# EAGLE design PGTNXEN_gate_out (EAGLE 8.5.2)
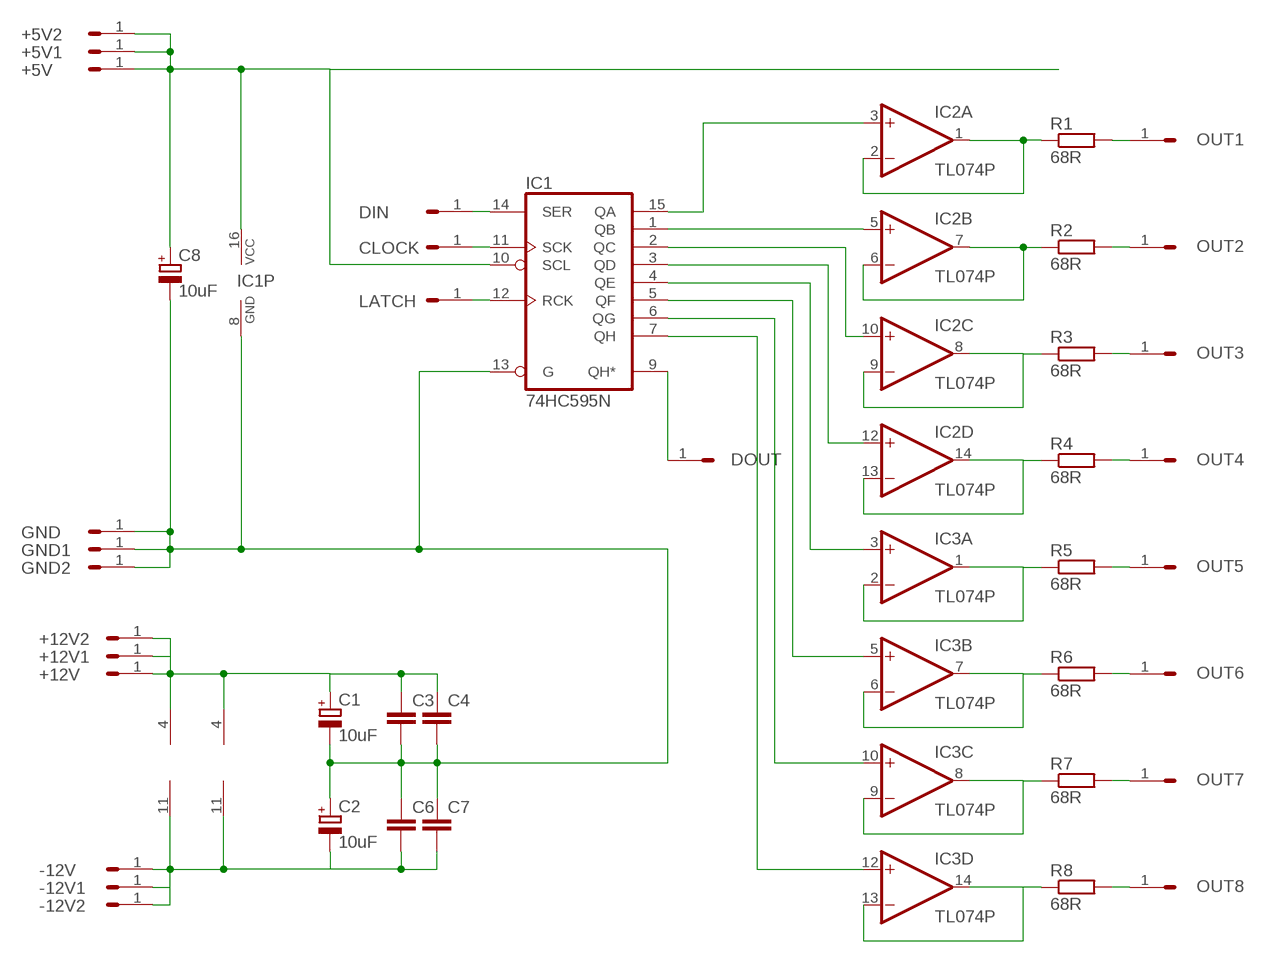
[diagram p0: schematic, sheet 1]

## Parts
+5V  HEADER/MALE/01  [HEADER/MALE/01]
+5V1  HEADER/MALE/01  [HEADER/MALE/01]
+5V2  HEADER/MALE/01  [HEADER/MALE/01]
+12V  HEADER/MALE/01  [HEADER/MALE/01]
+12V1  HEADER/MALE/01  [HEADER/MALE/01]
+12V2  HEADER/MALE/01  [HEADER/MALE/01]
-12V  HEADER/MALE/01  [HEADER/MALE/01]
-12V1  HEADER/MALE/01  [HEADER/MALE/01]
-12V2  HEADER/MALE/01  [HEADER/MALE/01]
C1  10uF  CAPACITOR/POLARIZEDE2.5-6  [E2,5-6]
C2  10uF  CAPACITOR/POLARIZEDE2.5-6  [E2,5-6]
C3  CAPACITORCERAMICDISC/5  [CERAMICDISC/5]
C4  CAPACITORCERAMICDISC/5  [CERAMICDISC/5]
C6  CAPACITORCERAMICDISC/5  [CERAMICDISC/5]
C7  CAPACITORCERAMICDISC/5  [CERAMICDISC/5]
C8  10uF  CAPACITOR/POLARIZEDE2.5-6  [E2,5-6]
CLOCK  HEADER/MALE/01  [HEADER/MALE/01]
DIN  HEADER/MALE/01  [HEADER/MALE/01]
DOUT  HEADER/MALE/01  [HEADER/MALE/01]
GND  HEADER/MALE/01  [HEADER/MALE/01]
GND1  HEADER/MALE/01  [HEADER/MALE/01]
GND2  HEADER/MALE/01  [HEADER/MALE/01]
IC1  74HC595N  [DIL16]
IC2  TL074P  [DIL14]
IC3  TL074P  [DIL14]
LATCH  HEADER/MALE/01  [HEADER/MALE/01]
OUT1  HEADER/MALE/01  [HEADER/MALE/01]
OUT2  HEADER/MALE/01  [HEADER/MALE/01]
OUT3  HEADER/MALE/01  [HEADER/MALE/01]
OUT4  HEADER/MALE/01  [HEADER/MALE/01]
OUT5  HEADER/MALE/01  [HEADER/MALE/01]
OUT6  HEADER/MALE/01  [HEADER/MALE/01]
OUT7  HEADER/MALE/01  [HEADER/MALE/01]
OUT8  HEADER/MALE/01  [HEADER/MALE/01]
R1  68R  RESISTORRESISTOR/UPRIGHT/7.5  [RESISTOR/7.5]
R2  68R  RESISTORRESISTOR/UPRIGHT/7.5  [RESISTOR/7.5]
R3  68R  RESISTORRESISTOR/UPRIGHT/7.5  [RESISTOR/7.5]
R4  68R  RESISTORRESISTOR/UPRIGHT/7.5  [RESISTOR/7.5]
R5  68R  RESISTORRESISTOR/UPRIGHT/7.5  [RESISTOR/7.5]
R6  68R  RESISTORRESISTOR/UPRIGHT/7.5  [RESISTOR/7.5]
R7  68R  RESISTORRESISTOR/UPRIGHT/7.5  [RESISTOR/7.5]
R8  68R  RESISTORRESISTOR/UPRIGHT/7.5  [RESISTOR/7.5]

## Nets
CLK: +5V1.1 +5V2.1 +5V.1 C8.+ IC1.10(SCL) IC1.16(VCC)
GND: C1.- C2.+ C3.2 C4.2 C6.1 C7.1 C8.- GND1.1 GND2.1 GND.1 IC1.8(GND) IC1.13(G)
N$1: IC1.15(QA) IC2.3(A:+IN)
N$2: IC1.1(QB) IC2.5(B:+IN)
N$3: CLOCK.1 IC1.11(SCK)
N$4: DIN.1 IC1.14(SER)
N$5: IC1.12(RCK) LATCH.1
N$6: IC1.2(QC) IC2.10(C:+IN)
N$7: IC1.3(QD) IC2.12(D:+IN)
N$8: IC1.4(QE) IC3.3(A:+IN)
N$9: IC1.5(QF) IC3.5(B:+IN)
N$10: IC1.6(QG) IC3.10(C:+IN)
N$11: IC1.7(QH) IC3.12(D:+IN)
N$12: DOUT.1 IC1.9(QH*)
N$13: IC2.1(A:OUT) IC2.2(A:-IN) R1.1
N$14: OUT1.1 R1.2
N$15: IC2.6(B:-IN) IC2.7(B:OUT) R2.1
N$16: OUT2.1 R2.2
N$17: +12V1.1 +12V2.1 +12V.1 C1.+ C3.1 C4.1 IC2.4(P:V+) IC3.4(P:V+)
N$18: -12V1.1 -12V2.1 -12V.1 C2.- C6.2 C7.2 IC2.11(P:V-) IC3.11(P:V-)
N$21: IC2.8(C:OUT) IC2.9(C:-IN) R3.1
N$22: IC2.13(D:-IN) IC2.14(D:OUT) R4.1
N$23: IC3.1(A:OUT) IC3.2(A:-IN) R5.1
N$24: IC3.6(B:-IN) IC3.7(B:OUT) R6.1
N$25: IC3.8(C:OUT) IC3.9(C:-IN) R7.1
N$26: IC3.13(D:-IN) IC3.14(D:OUT) R8.1
N$27: OUT3.1 R3.2
N$28: OUT4.1 R4.2
N$29: OUT5.1 R5.2
N$30: OUT6.1 R6.2
N$31: OUT7.1 R7.2
N$32: OUT8.1 R8.2

## Library data of the parts
+5V +5V1 +5V2 +12V +12V1 +12V2 -12V -12V1 -12V2 CLOCK DIN DOUT GND GND1 GND2 LATCH OUT1-OUT8 = connectors:HEADER/MALE/01
C1 C2 C8 = capacitors:CAPACITOR/POLARIZED: POLARIZED CAPACITOR, European symbol
C3 C4 C6 C7 = capacitors:CAPACITOR: CAPACITOR, European symbol
IC1 = ic_digital:74*595: 8-bit SHIFT REGISTER, output latch
IC2 IC3 = ic_analogue:TL074: OP AMP
R1-R8 = resistors:RESISTOR: RESISTOR, European symbol

## Board
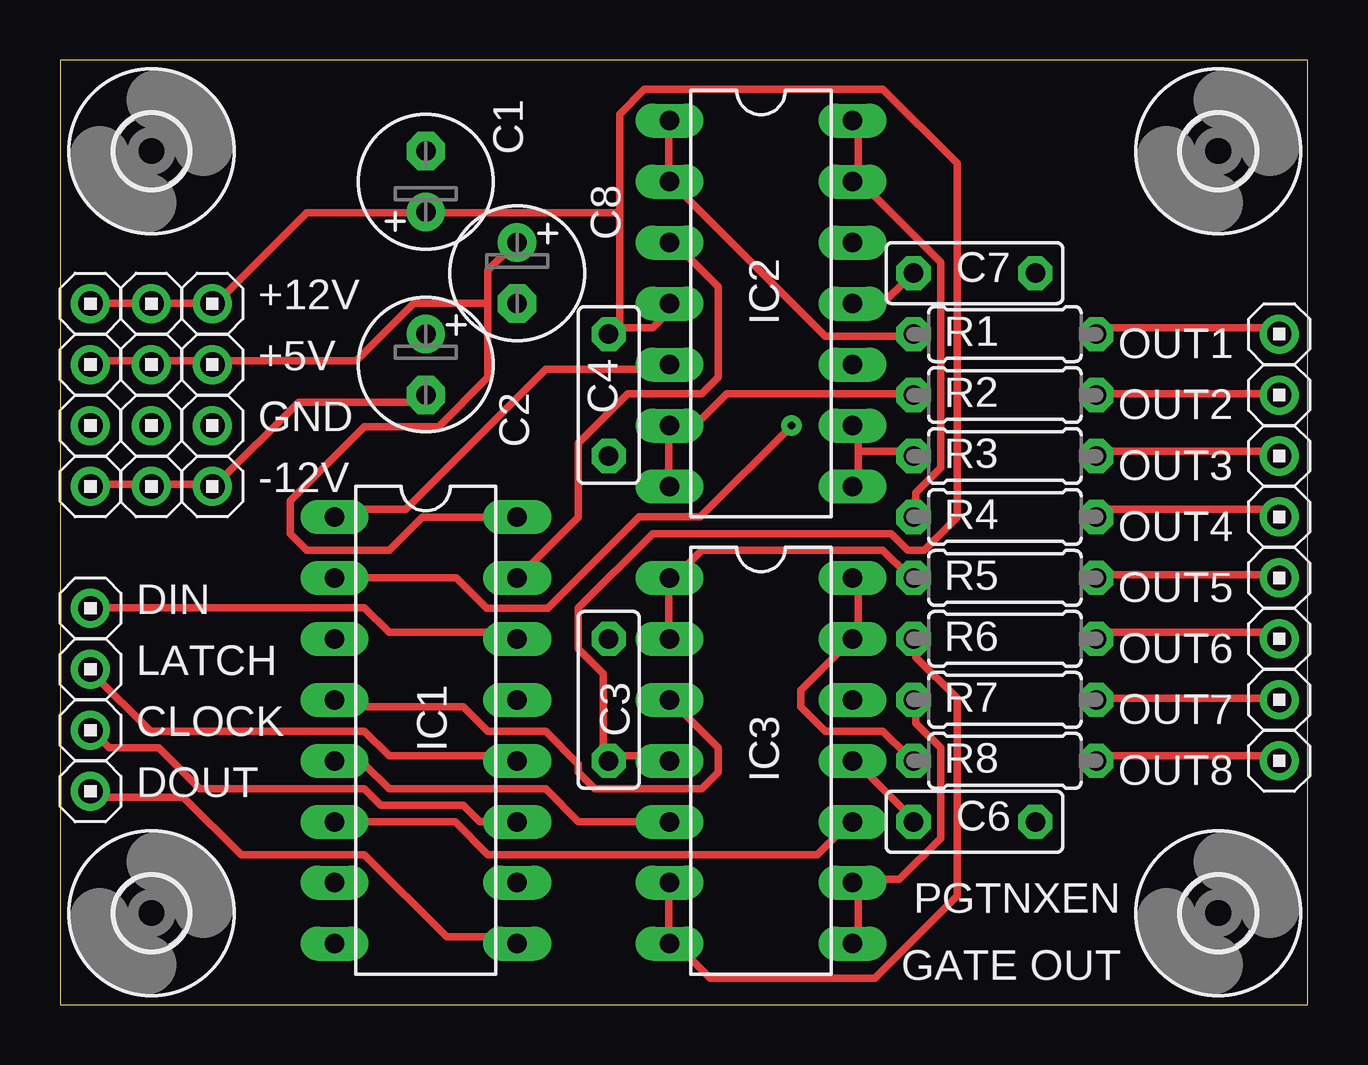
[diagram p1: board, top side]
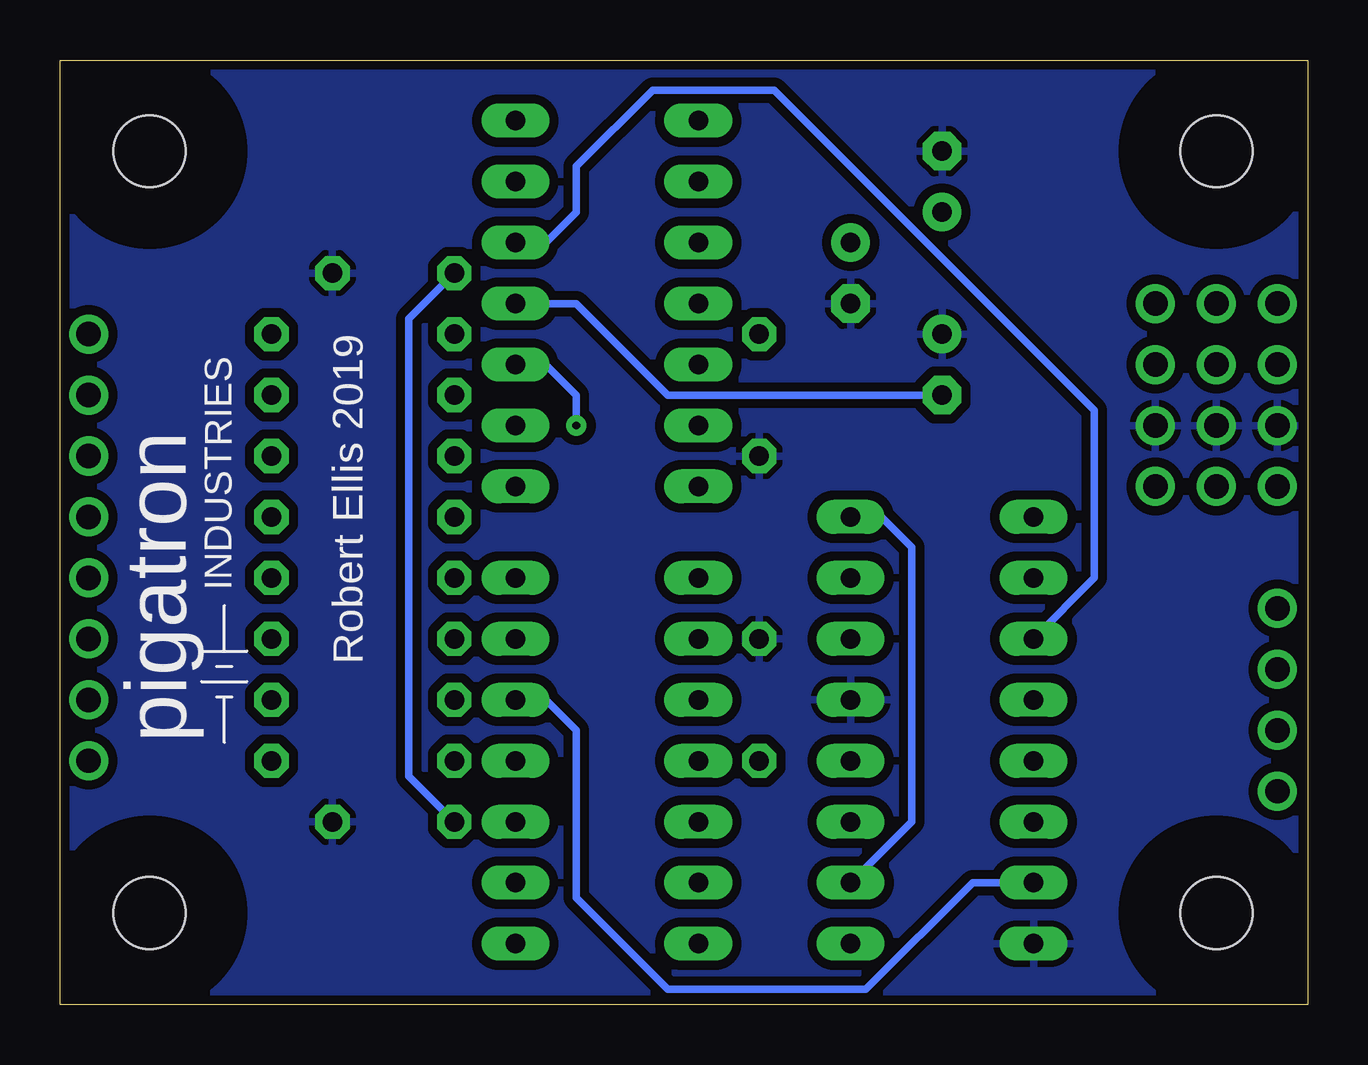
[diagram p2: board, bottom side, seen from below]

Size 51.99 x 39.36 mm. Coordinates in mm from the lower left corner, seen from the top.
Outline: 0,0 51.99,0 51.99,39.36 0,39.36 0,0
Copper layers (1*16): Top 0.0356mm / dielectric 1.5011mm / Bottom 0.0356mm
Design rules "pigatron": minimum track width 12mil, minimum drill 13mil, track to track 15mil, track to pad 10mil, pad to pad 10mil, via to via 10mil, smd to smd 6mil, copper to edge 15mil, drill to drill 10mil, minimum pad ring 12mil, minimum via ring 10mil, stop-mask expansion 4mil, vias tented up to drill 0mil, thermal gap 10mil

### Footprints (pad centres in the part's own frame; a part is rotated, then mirrored left to right if it is on the bottom)
HEADER/MALE/01 = drill 1.016: 1 0,0
E2,5-6 = drill 0.813 pad 1.6: + -1.27,0 | drill 0.813 pad 1.6 octagon: - 1.27,0
CERAMICDISC/5 = drill 0.813 octagon: 1 -2.54,0; 2 2.54,0
DIL16 = drill 0.813 long: 1 -8.89,-3.81; 2 -6.35,-3.81; 3 -3.81,-3.81; 4 -1.27,-3.81; 5 1.27,-3.81; 6 3.81,-3.81; 7 6.35,-3.81; 8 8.89,-3.81; 9 8.89,3.81; 10 6.35,3.81; 11 3.81,3.81; 12 1.27,3.81; 13 -1.27,3.81; 14 -3.81,3.81; 15 -6.35,3.81; 16 -8.89,3.81
DIL14 = drill 0.813 long: 1 -7.62,-3.81; 2 -5.08,-3.81; 3 -2.54,-3.81; 4 0,-3.81; 5 2.54,-3.81; 6 5.08,-3.81; 7 7.62,-3.81; 8 7.62,3.81; 9 5.08,3.81; 10 2.54,3.81; 11 0,3.81; 12 -2.54,3.81; 13 -5.08,3.81; 14 -7.62,3.81
RESISTOR/7.5 = drill 0.813 octagon: 1 -3.81,0; 2 3.81,0
STANDOFF/3.0 = hole 3: 0,0

### Placement (x,y rotation side)
+5V  6.35,26.67 0 top
+5V1  3.81,26.67 0 top
+5V2  1.27,26.67 0 top
+12V  6.35,29.21 0 top
+12V1  3.81,29.21 0 top
+12V2  1.27,29.21 0 top
-12V  6.35,21.59 0 top
-12V1  3.81,21.59 0 top
-12V2  1.27,21.59 0 top
C1  15.24,34.29 90 top
C2  15.24,26.67 270 top
C3  22.86,12.7 90 top
C4  22.86,25.4 270 top
C6  38.1,7.62 180 top
C7  38.1,30.48 180 top
C8  19.05,30.48 270 top
CLOCK  1.27,11.43 0 top
DIN  1.27,16.51 0 top
DOUT  1.27,8.89 0 top
GND  6.35,24.13 0 top
GND1  1.27,24.13 0 top
GND2  3.81,24.13 0 top
IC1  15.24,11.43 270 top
IC2  29.21,29.21 270 top
IC3  29.21,10.16 270 top
LATCH  1.27,13.97 0 top
OUT1  50.8,27.94 180 top
OUT2  50.8,25.4 180 top
OUT3  50.8,22.86 180 top
OUT4  50.8,20.32 180 top
OUT5  50.8,17.78 180 top
OUT6  50.8,15.24 180 top
OUT7  50.8,12.7 180 top
OUT8  50.8,10.16 180 top
R1  39.37,27.94 0 top
R2  39.37,25.4 0 top
R3  39.37,22.86 0 top
R4  39.37,20.32 0 top
R5  39.37,17.78 0 top
R6  39.37,15.24 0 top
R7  39.37,12.7 0 top
R8  39.37,10.16 0 top
U$1  [STANDOFF/3.0]  3.81,3.81 0 top
U$2  [STANDOFF/3.0]  48.26,3.81 0 top
U$3  [STANDOFF/3.0]  48.26,35.56 0 top
U$4  [STANDOFF/3.0]  3.81,35.56 0 top
U$5  [PIGATRON-LOGO]  46.74,19.81 90 bottom

### Tracks (layer width: path | path; a pad name or v marks a point on that pad's centre or on a via)
CLK
  Top 0.305: +5V2.1 1.37,26.82 3.77,26.82 +5V1.1 4.12,26.82 6.17,26.82 +5V.1 6.51,26.82 12.34,26.82 14.74,29.22 17.83,29.22 | 17.83,29.22 17.83,30.59 18.86,31.62 C8.+ | 17.83,29.22 17.83,26.14 15.77,24.08 12.69,24.08 9.6,20.99 9.6,19.62 10.29,18.94 13.72,18.94 15.09,20.31 18.86,20.31 IC1.16
  Bottom 0.305: IC1.10 16.51,7.62 16.51,19.05 17.78,20.32 IC1.16
GND
  pour Bottom: 0,39.37 0,0 52.07,0 52.07,39.37
N$1
  Top 0.305: IC1.15 19.2,17.91 21.6,20.31 21.6,23.39 23.66,25.45 26.75,25.45 27.43,26.14 27.43,29.91 25.72,31.62 IC2.3
N$2
  Top 0.305: IC1.1 11.66,20.65 14.4,20.65 20.23,26.48 25.38,26.48 IC2.5
N$3
  Top 0.305: IC1.11 17.49,7.62 16.8,8.31 13.37,8.31 12.69,8.99 5.83,8.99 4.12,10.71 2.06,10.71 1.37,11.39 CLOCK.1
N$4
  Top 0.305: IC1.14 18.86,15.51 13.72,15.51 12.69,16.53 1.37,16.53 DIN.1
N$5
  Top 0.305: IC1.12 18.86,10.36 13.72,10.36 12.69,11.39 3.77,11.39 1.37,13.79 LATCH.1
N$6  (via drill 0.33)
  Top 0.305: IC1.2 16.51,17.78 17.78,16.51 20.32,16.51 24.13,20.32 26.67,20.32 v30.48,24.13
  Bottom 0.305: v30.48,24.13 30.48,25.4 31.75,26.67 IC2.10
N$7
  Bottom 0.305: IC1.3 8.89,17.78 8.89,24.77 22.23,38.1 27.3,38.1 30.48,34.92 30.48,33.02 31.75,31.75 IC2.12
N$8
  Top 0.305: IC1.4 11.66,12.42 16.8,12.42 17.83,11.39 20.23,11.39 21.6,10.02 21.6,9.68 22.29,8.99 26.75,8.99 27.43,9.68 27.43,10.71 25.72,12.42 IC3.3
N$9
  Top 0.305: IC3.5 21.6,7.62 20.23,8.99 13.72,8.99 12.69,10.02 11.66,10.02 IC1.5
N$10
  Top 0.305: IC1.6 16.46,7.62 17.83,6.25 31.55,6.25 32.92,7.62 IC3.10
N$11
  Bottom 0.305: IC1.7 13.97,5.08 18.41,0.63 26.67,0.63 30.48,4.44 30.48,11.43 31.75,12.7 IC3.12
N$12
  Top 0.305: IC1.9 18.86,2.82 16.12,2.82 12.69,6.25 7.54,6.25 5.14,8.65 1.37,8.65 DOUT.1
N$13
  Top 0.305: IC2.1 25.38,36.77 25.38,34.37 IC2.2 25.72,34.02 31.89,27.85 35.32,27.85 R1.1
N$14
  Top 0.305: R1.2 43.2,28.19 50.75,28.19 OUT1.1
N$15
  Top 0.305: IC2.7 25.38,21.68 25.38,24.08 IC2.6 25.72,24.42 26.75,24.42 27.77,25.45 35.32,25.45 R2.1
N$16
  Top 0.305: R2.2 43.2,25.45 50.75,25.45 OUT2.1
N$17
  Top 0.305: +12V2.1 1.37,29.22 3.77,29.22 +12V1.1 4.12,29.22 6.17,29.22 +12V.1 6.51,29.22 10.29,32.99 15.09,32.99 C1.+ 15.43,32.99 23.32,32.99 | IC3.4 25.38,10.36 22.97,10.36 C3.1 22.63,10.36 22.63,13.79 21.6,14.82 21.6,16.53 24.69,19.62 34.63,19.62 35.32,18.94 36.01,18.94 37.38,20.31 37.38,35.05 34.29,38.14 24.35,38.14 23.32,37.11 23.32,32.99 | 23.32,28.19 24.69,28.19 25.38,28.88 IC2.4 | 23.32,28.19 22.97,28.19 C4.1 23.32,28.19 | 23.32,28.19 23.32,32.99
N$18
  Top 0.305: IC3.11 33.26,10.02 35.66,7.62 C6.2 | -12V2.1 1.37,21.68 3.77,21.68 -12V1.1 4.12,21.68 6.17,21.68 -12V.1 6.51,21.68 9.94,25.11 15.09,25.11 C2.- | IC2.11 33.26,29.22 34.29,29.22 35.32,30.25 C7.2
  Bottom 0.305: C7.2 37.47,28.57 37.47,9.52 C6.2 | IC2.11 30.48,29.21 26.67,25.4 C2.-
N$21
  Top 0.305: 33.26,23.05 33.26,24.08 IC2.9 | 33.26,23.05 33.26,21.68 IC2.8 | 33.26,23.05 35.32,23.05 R3.1
N$22
  Top 0.305: 33.26,34.37 33.26,36.77 IC2.14 | 33.26,34.37 36.69,30.94 36.69,22.36 35.66,21.34 35.66,20.65 R4.1 | 33.26,34.37 IC2.13
N$23
  Top 0.305: IC3.2 25.38,15.51 25.38,17.56 IC3.1 25.72,17.91 26.75,18.94 34.29,18.94 35.32,17.91 R5.1
N$24
  Top 0.305: IC3.6 25.38,4.88 25.38,2.82 IC3.7 25.72,2.48 27.09,1.1 33.95,1.1 37.38,4.53 37.38,12.76 35.66,14.48 35.66,15.16 R6.1
N$25
  Top 0.305: IC3.8 33.26,2.82 33.26,4.88 IC3.9 33.26,5.22 34.98,5.22 36.69,6.93 36.69,10.71 35.66,11.73 35.66,12.42 R7.1
N$26
  Top 0.305: IC3.14 33.26,17.56 33.26,15.51 IC3.13 32.92,15.16 30.86,13.11 30.86,12.42 31.89,11.39 34.29,11.39 35.32,10.36 R8.1
N$27
  Top 0.305: R3.2 43.2,23.05 50.75,23.05 OUT3.1
N$28
  Top 0.305: R4.2 43.2,20.65 50.75,20.65 OUT4.1
N$29
  Top 0.305: R5.2 43.2,17.91 50.75,17.91 OUT5.1
N$30
  Top 0.305: R6.2 43.2,15.51 50.75,15.51 OUT6.1
N$31
  Top 0.305: R7.2 43.2,12.76 50.75,12.76 OUT7.1
N$32
  Top 0.305: R8.2 43.2,10.36 50.75,10.36 OUT8.1

### Text on the board
tPlace: PGTNXEN | GATE OUT
bPlace: Robert Ellis 2019